# Altium schematic sheet ESP32P4.SchDoc
size A4; SheetNumber: 4; SheetTotal: 5
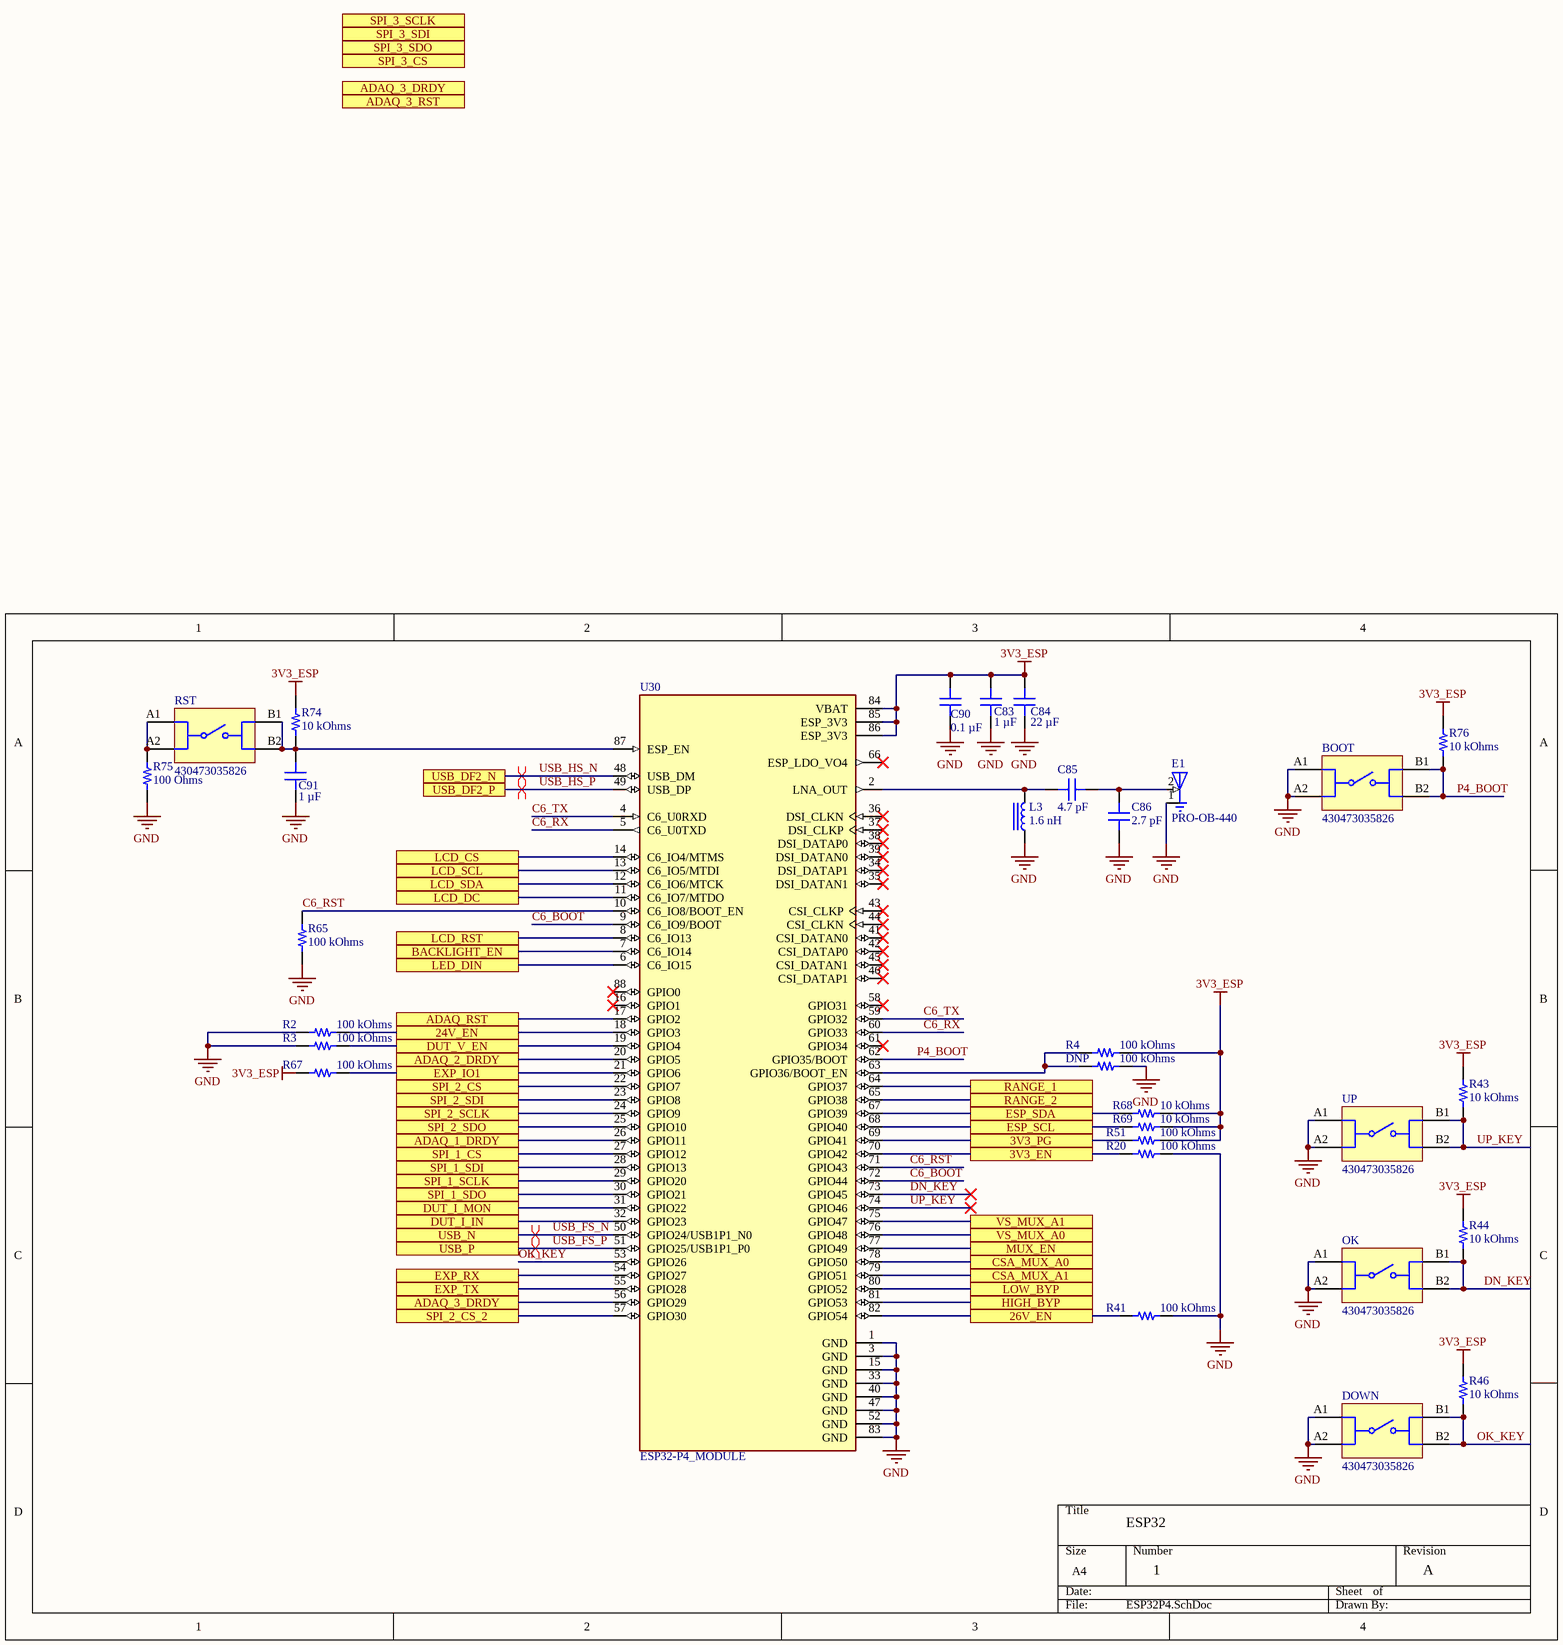
[diagram p0: ESP32P4.SchDoc]

## Parts
BOOT  430473035826  [430473035826]
C83  1 µF  [CAP 0603_1608]
C84  22 µF  [CAP 0603_1608]
C85  4.7 pF  [CAP 0603_1608]
C86  2.7 pF  [CAP 0603_1608]
C90  0.1 µF  [CAP 0603_1608]
C91  1 µF  [CAP 0603_1608]
DNP  100 kOhms  [RES 0603_1608]
DOWN  430473035826  [430473035826]
E1  PRO-OB-440  [XDCR_PRO-OB-440]
L3  1.6 nH  [Murata LQW18 0603]
OK  430473035826  [430473035826]
R2  100 kOhms  [RES 0603_1608]
R3  100 kOhms  [RES 0603_1608]
R4  100 kOhms  [RES 0603_1608]
R20  100 kOhms  [RES 0603_1608]
R41  100 kOhms  [RES 0603_1608]
R43  10 kOhms  [RES 0603_1608]
R44  10 kOhms  [RES 0603_1608]
R46  10 kOhms  [RES 0603_1608]
R51  100 kOhms  [RES 0603_1608]
R65  100 kOhms  [RES 0603_1608]
R67  100 kOhms  [RES 0603_1608]
R68  10 kOhms  [RES 0603_1608]
R69  10 kOhms  [RES 0603_1608]
R74  10 kOhms  [RES 0603_1608]
R75  100 Ohms  [RES 0603_1608]
R76  10 kOhms  [RES 0603_1608]
RST  430473035826  [430473035826]
U30  ESP32-P4_MODULE  [XCVR_ESP32-P4_MODULE]
UP  430473035826  [430473035826]

## Ports
3V3_EN, 3V3_PG, 24V_EN, 26V_EN, ADAQ_1_DRDY, ADAQ_2_DRDY, ADAQ_3_DRDY, ADAQ_3_RST, ADAQ_RST, BACKLIGHT_EN, CSA_MUX_A0, CSA_MUX_A1, DUT_I_IN, DUT_I_MON, DUT_V_EN, ESP_SCL, ESP_SDA, EXP_IO1, EXP_RX, EXP_TX, HIGH_BYP, LCD_CS, LCD_DC, LCD_RST, LCD_SCL, LCD_SDA, LED_DIN, LOW_BYP, MUX_EN, RANGE_1, RANGE_2, SPI_1_CS, SPI_1_SCLK, SPI_1_SDI, SPI_1_SDO, SPI_2_CS, SPI_2_CS_2, SPI_2_SCLK, SPI_2_SDI, SPI_2_SDO, SPI_3_CS, SPI_3_SCLK, SPI_3_SDI, SPI_3_SDO, USB_DF2_N, USB_DF2_P, USB_N, USB_P, VS_MUX_A0, VS_MUX_A1

## Nets
3V3_ESP: C83.2 C84.2 C90.2 R4.2 R43.2 R44.2 R46.2 R51.2 R67.1 R68.2 R69.2 R74.2 R76.2 U30.84(VBAT) U30.85(ESP_3V3) U30.86(ESP_3V3)
GND: BOOT.A1 BOOT.A2 C83.1 C84.1 C86.1 C90.1 C91.1 DNP.2 DOWN.A1 DOWN.A2 E1.1(GND) L3.1 OK.A1 OK.A2 R2.1 R3.1 R20.2 R41.2 R65.2 R75.1 U30.1(GND) U30.3(GND) U30.15(GND) U30.33(GND) U30.40(GND) U30.47(GND) U30.52(GND) U30.83(GND) UP.A1 UP.A2
3V3_EN: R20.1 U30.70(GPIO42) ; port 3V3_EN
3V3_PG: R51.1 U30.69(GPIO41) ; port 3V3_PG
24V_EN: R2.2 U30.18(GPIO3) ; port 24V_EN
26V_EN: R41.1 U30.82(GPIO54) ; port 26V_EN
ADAQ_1_DRDY: U30.26(GPIO11) ; port ADAQ_1_DRDY
ADAQ_2_DRDY: U30.20(GPIO5) ; port ADAQ_2_DRDY
ADAQ_3_DRDY: U30.56(GPIO29) ; port ADAQ_3_DRDY
ADAQ_RST: U30.17(GPIO2) ; port ADAQ_RST
BACKLIGHT_EN: U30.7(C6_IO14) ; port BACKLIGHT_EN
C6_BOOT: U30.9(C6_IO9/BOOT) U30.72(GPIO44)
C6_RST: R65.1 U30.10(C6_IO8/BOOT_EN) U30.71(GPIO43)
C6_RX: U30.5(C6_U0TXD) U30.60(GPIO33)
C6_TX: U30.4(C6_U0RXD) U30.59(GPIO32)
CSA_MUX_A0: U30.78(GPIO50) ; port CSA_MUX_A0
CSA_MUX_A1: U30.79(GPIO51) ; port CSA_MUX_A1
DN_KEY: OK.B1 OK.B2 R44.1 U30.73(GPIO45)
DUT_I_IN: U30.32(GPIO23) ; port DUT_I_IN
DUT_I_MON: U30.31(GPIO22) ; port DUT_I_MON
DUT_V_EN: R3.2 U30.19(GPIO4) ; port DUT_V_EN
ESP_SCL: R69.1 U30.68(GPIO40) ; port ESP_SCL
ESP_SDA: R68.1 U30.67(GPIO39) ; port ESP_SDA
EXP_IO1: R67.2 U30.21(GPIO6) ; port EXP_IO1
EXP_RX: U30.54(GPIO27) ; port EXP_RX
EXP_TX: U30.55(GPIO28) ; port EXP_TX
HIGH_BYP: U30.81(GPIO53) ; port HIGH_BYP
LCD_CS: U30.14(C6_IO4/MTMS) ; port LCD_CS
LCD_DC: U30.11(C6_IO7/MTDO) ; port LCD_DC
LCD_RST: U30.8(C6_IO13) ; port LCD_RST
LCD_SCL: U30.13(C6_IO5/MTDI) ; port LCD_SCL
LCD_SDA: U30.12(C6_IO6/MTCK) ; port LCD_SDA
LED_DIN: U30.6(C6_IO15) ; port LED_DIN
LOW_BYP: U30.80(GPIO52) ; port LOW_BYP
MUX_EN: U30.77(GPIO49) ; port MUX_EN
OK_KEY: DOWN.B1 DOWN.B2 R46.1 U30.53(GPIO26)
P4_BOOT: BOOT.B1 BOOT.B2 R76.1 U30.62(GPIO35/BOOT)
RANGE_1: U30.64(GPIO37) ; port RANGE_1
RANGE_2: U30.65(GPIO38) ; port RANGE_2
SPI_1_CS: U30.27(GPIO12) ; port SPI_1_CS
SPI_1_SCLK: U30.29(GPIO20) ; port SPI_1_SCLK
SPI_1_SDI: U30.28(GPIO13) ; port SPI_1_SDI
SPI_1_SDO: U30.30(GPIO21) ; port SPI_1_SDO
SPI_2_CS: U30.22(GPIO7) ; port SPI_2_CS
SPI_2_CS_2: U30.57(GPIO30) ; port SPI_2_CS_2
SPI_2_SCLK: U30.24(GPIO9) ; port SPI_2_SCLK
SPI_2_SDI: U30.23(GPIO8) ; port SPI_2_SDI
SPI_2_SDO: U30.25(GPIO10) ; port SPI_2_SDO
UP_KEY: R43.1 U30.74(GPIO46) UP.B1 UP.B2
USB_FS_N: U30.50(GPIO24/USB1P1_N0) ; port USB_N
USB_FS_P: U30.51(GPIO25/USB1P1_P0) ; port USB_P
USB_HS_N: U30.48(USB_DM) ; port USB_DF2_N
USB_HS_P: U30.49(USB_DP) ; port USB_DF2_P
VS_MUX_A0: U30.76(GPIO48) ; port VS_MUX_A0
VS_MUX_A1: U30.75(GPIO47) ; port VS_MUX_A1
NetC85_1: C85.1 C86.2 E1.2(FEED)
NetC85_2: C85.2 L3.2 U30.2(LNA_OUT)
NetC91_2: C91.2 R74.1 RST.B1 RST.B2 U30.87(ESP_EN)
NetDNP_1: DNP.1 R4.1 U30.63(GPIO36/BOOT_EN)
NetR75_2: R75.2 RST.A1 RST.A2

Not connected (* = marked no-connect by the designer): U30 16(GPIO1)* 34(DSI_DATAP1)* 35(DSI_DATAN1)* 36(DSI_CLKN)* 37(DSI_CLKP)* 38(DSI_DATAP0)* 39(DSI_DATAN0)* 41(CSI_DATAN0)* 42(CSI_DATAP0)* 43(CSI_CLKP)* 44(CSI_CLKN)* 45(CSI_DATAN1)* 46(CSI_DATAP1)* 58(GPIO31)* 61(GPIO34)* 66(ESP_LDO_VO4)* 88(GPIO0)*

## Layout directives
differential pair; differential pair class USB: USB_FS_N, USB_FS_P, USB_HS_N, USB_HS_P

## Notes on the sheet
- ESP32
- 1
- A

## Library data of the parts
BOOT DOWN OK RST UP = CMP-1455-00006-5: Switch Tactile Spst-no 0.05A 12V; Actuator Material: Liquid Crystal Polymer, Polymer; Switch Travel: 250µm; Throw Configuration: SPST; Illumination Type: Non-Illuminated; Insulation Resistance: 100MΩ; Current Rating: 50mA; Switch Function: Off-Mom; Mechanical Life: 500kcycles; Min Operating Temperature: -40°C; Packaging: Tape and Reel; Max Operating Temperature: 85°C; Mount: Surface Mount; Contact Plating: Silver; RoHS: Compliant; Voltage Rating: 12V; Height: 3.5mm
C83 C91 = GMC10X7R105M50NT: SMT Capacitor; manufacturer: Cal-Chip Electronics, Inc.; Temperature Coefficient: X7R; Tolerance: ±20%; Voltage - Rated: 50V; Part Number: GMC10X7R105M50NT; Applications: General Purpose; Capacitance: 1 µF; componentlink1description: Datasheet; componentlink1url: https://calchip.com/wp-content/uploads/2024/02/gmc_series-1.pdf; componentlink2description: DigiKey Link; componentlink2url: https://www.digikey.com/en/products/detail/cal-chip-electronics-inc/GMC10X7R105M50NT/25323876; Device Package: 0603 (1608 Metric); lastupdated: 06/04/2026 19:17:52; Lifecycle Status: Active; Minimum Order: 1; Mounting Type: Surface Mount, MLCC; Operating Temperature: -55°C ~ 125°C; Package / Case: 0603 (1608 Metric); packaging: TapeAndReel; partid: 65934; price: 0.06; series: GMC; Size / Dimension: 0.063" L x 0.031" W (1.60mm x 0.80mm); Supplier 1: DigiKey; Supplier Part Number 1: 4713-GMC10X7R105M50NTCT-ND; Thickness (Max): 0.037" (0.95mm); value: 1 µF
C84 = GRM188C61C226ME01D: SMT Capacitor; manufacturer: Murata Electronics; Temperature Coefficient: X5S; Tolerance: ±20%; Voltage - Rated: 16V; Part Number: GRM188C61C226ME01D; value: 22 µF; Applications: General Purpose; Capacitance: 22 µF; componentlink1description: Datasheet; componentlink1url: https://search.murata.co.jp/Ceramy/image/img/A01X/G101/ENG/GRM188C61C226ME01-01A.pdf; componentlink2description: DigiKey Link; componentlink2url: https://www.digikey.com/en/products/detail/murata-electronics/GRM188C61C226ME01D/22528395; Device Package: 0603 (1608 Metric); lastupdated: 06/04/2026 19:18:15; Lifecycle Status: Active; Minimum Order: 1; Mounting Type: Surface Mount, MLCC; Operating Temperature: -55°C ~ 85°C; Package / Case: 0603 (1608 Metric); packaging: TapeAndReel; partid: 60294; price: 0.08; series: GRM; Size / Dimension: 0.063" L x 0.031" W (1.60mm x 0.80mm); Supplier 1: DigiKey; Supplier Part Number 1: 490-GRM188C61C226ME01DCT-ND; Thickness (Max): 0.039" (1.00mm)
C85 = 06035C4R7KAT2A: SMT Capacitor; manufacturer: KYOCERA AVX; Temperature Coefficient: X7R; Tolerance: ±10%; Voltage - Rated: 50V; Part Number: 06035C4R7KAT2A; value: 4.7 pF; Applications: General Purpose; Capacitance: 4.7 pF; componentlink2description: DigiKey Link; componentlink2url: https://www.digikey.com/en/products/detail/kyocera-avx/06035C4R7KAT2A/11259106; Device Package: 0603 (1608 Metric); lastupdated: 06/04/2026 19:18:45; Lifecycle Status: Active; Minimum Order: 1; Mounting Type: Surface Mount, MLCC; Operating Temperature: -55°C ~ 125°C; Package / Case: 0603 (1608 Metric); packaging: TapeAndReel; partid: 68839; price: 0.03; series: -; Size / Dimension: 0.063" L x 0.032" W (1.60mm x 0.81mm); Supplier 1: DigiKey; Supplier Part Number 1: 478-06035C4R7KAT2ACT-ND; Thickness (Max): 0.035" (0.90mm)
C86 = C0603C279D5GAC7867: SMT Capacitor; manufacturer: KEMET; Temperature Coefficient: C0G, NP0; Tolerance: ±0.5pF; Voltage - Rated: 50V; Part Number: C0603C279D5GAC7867; value: 2.7 pF; Applications: General Purpose; Capacitance: 2.7 pF; componentlink1description: Datasheet; componentlink1url: https://api.kemet.com/component-edge/download/datasheet/C0603C279D5GACTU.pdf; componentlink2description: DigiKey Link; componentlink2url: https://www.digikey.com/en/products/detail/kemet/C0603C279D5GAC7867/2200451; Device Package: 0603 (1608 Metric); Features: Low ESL; lastupdated: 06/04/2026 19:22:23; Lifecycle Status: Active; Minimum Order: 1; Mounting Type: Surface Mount, MLCC; Operating Temperature: -55°C ~ 125°C; Package / Case: 0603 (1608 Metric); packaging: TapeAndReel; partid: 34968; Part Status: Active; price: 0.04; series: SMD Comm C0G; Size / Dimension: 0.063" L x 0.031" W (1.60mm x 0.80mm); Supplier 1: DigiKey; Supplier Part Number 1: 399-C0603C279D5GAC7867CT-ND; Thickness (Max): 0.034" (0.87mm)
C90 = C0603C104M5RACTU: SMT Capacitor; manufacturer: KEMET; Temperature Coefficient: X7R; Tolerance: ±20%; Voltage - Rated: 50V; Part Number: C0603C104M5RACTU; value: 0.1 µF; Applications: Bypass, Decoupling; Capacitance: 0.1 µF; componentlink1description: Datasheet; componentlink1url: https://api.kemet.com/component-edge/download/datasheet/C0603C104M5RACTU.pdf; componentlink2description: DigiKey Link; componentlink2url: https://www.digikey.com/en/products/detail/kemet/C0603C104M5RACTU/2199782; Device Package: 0603 (1608 Metric); lastupdated: 06/04/2026 19:22:47; Lifecycle Status: Active; Minimum Order: 1; Mounting Type: Surface Mount, MLCC; Operating Temperature: -55°C ~ 125°C; Package / Case: 0603 (1608 Metric); packaging: CutTape; partid: 69106; Part Status: Active; price: 0.01; series: SMD Comm X7R; Size / Dimension: 0.063" L x 0.031" W (1.60mm x 0.80mm); Supplier 1: DigiKey; Supplier Part Number 1: 399-C0603C104M5RACTUCT-ND; Thickness (Max): 0.034" (0.87mm)
DNP R2-R4 R20 R41 R51 R65 R67 = ERJ-PA3F1003V: RES SMD 100K OHM 1% 1/3W 0603; Manufacturer: Panasonic Electronic Components; Power (Watts): 0.333W 1/3W; Temperature Coefficient: Â±100ppm/Â°C; Tolerance: Â±1%; ComponentLink1Description: Datasheet; ComponentLink1URL: https://industrial.panasonic.com/cdbs/www-data/pdf/RDO0000/AOA0000C331.pdf; ComponentLink2Description: DigiKey Link; ComponentLink2URL: https://www.digikey.com/en/products/detail/panasonic-electronic-components/ERJ-PA3F1003V/5035850; Composition: Thick Film; Device Package: 0603 (1608 Metric); Features: Automotive AEC-Q200 Pulse Withstanding; Height - Seated (Max): 0.022\ (0.55mm); LastUpdated: 2024-02-09 20:42:57.243000; Lifecycle Status: Active; Part Number: ERJ-PA3F1003V; Minimum Order: 1; Number of Terminations: 2; Operating Temperature: -55Â°C ~ 155Â°C; Package / Case: 0603 (1608 Metric); Packaging: TapeAndReel; PartId: 14879; Part Status: Active; Price: 0.01; Ratings: AEC-Q200; Resistance: 100 kOhms; Series: ERJ-PA3; Size / Dimension: 0.063\ L x 0.031\ W (1.60mm x 0.80mm); Supplier 1: DigiKey; Supplier Part Number 1: P100KBYCT-ND; Supplier Device Package: 0603; Value: 100 kOhms
E1 = PRO-OB-440: 2.4GHz Bluetooth, WirelessHART, WLAN, Zigbeeâ„¢ Stamped Metal RF Antenna 2.4GHz ~ 2.5GHz - Solder Surface Mount; MF: Abracon; SnapEDA_Link: https://www.snapeda.com/parts/PRO-OB-440/Abracon/view-part/?ref=snap; Package: None; Value: *; MP: PRO-OB-440; Check_prices: https://www.snapeda.com/parts/PRO-OB-440/Abracon/view-part/?ref=eda
L3 = LQW18AS1N6J0ZD: FIXED IND 1.6NH 700MA 30MOHM SMD; Manufacturer: Murata Electronics; DC Resistance (DCR): 30mOhm Max; Frequency - Self Resonant: 12.5GHz; Inductance Frequency - Test: 250 MHz; Material - Core: Non-Magnetic; Q @ Freq: 24 @ 250MHz; Shielding: Unshielded; Tolerance: ±5%; Type: Wirewound; Part Number: LQW18AS1N6J0ZD; ComponentLink1Description: Datasheet; ComponentLink1URL: https://search.murata.co.jp/Ceramy/image/img/P02/JELF243A-9139.pdf; ComponentLink2Description: DigiKey Link; ComponentLink2URL: https://www.digikey.com/en/products/detail/murata-electronics/LQW18AS1N6J0ZD/6799231; Current Rating (Amps): 700 mA; Device Package: 0603 (1608 Metric); Height - Seated (Max): 0.039" (1.00mm); Inductance: 1.6 nH; LastUpdated: 05/04/2026 21:06:49; Lifecycle Status: Active; Minimum Order: 1; Mounting Type: Surface Mount; Operating Temperature: -55°C ~ 125°C; Package / Case: 0603 (1608 Metric); Packaging: TapeAndReel; PartId: 873; Part Status: Active; Price: 0.05; Ratings: AEC-Q200; Series: LQW18; Size / Dimension: 0.063" L x 0.031" W (1.60mm x 0.80mm); Supplier 1: DigiKey; Supplier Part Number 1: 490-15806-1-ND; Supplier Device Package: 0603 (1608 Metric); Value: 1.6 nH
R43 R44 R46 R68 R69 R74 R76 = ERJ-PA3F1002V: RES SMD 10K OHM 1% 1/3W 0603; Manufacturer: Panasonic Electronic Components; Power (Watts): 0.333W 1/3W; Temperature Coefficient: Â±100ppm/Â°C; Tolerance: Â±1%; ComponentLink1Description: Datasheet; ComponentLink1URL: https://industrial.panasonic.com/cdbs/www-data/pdf/RDO0000/AOA0000C331.pdf; ComponentLink2Description: DigiKey Link; ComponentLink2URL: https://www.digikey.com/en/products/detail/panasonic-electronic-components/ERJ-PA3F1002V/5035849; Composition: Thick Film; Device Package: 0603 (1608 Metric); Features: Automotive AEC-Q200 Pulse Withstanding; Height - Seated (Max): 0.022\ (0.55mm); LastUpdated: 2024-02-09 20:42:57.847000; Lifecycle Status: Active; Part Number: ERJ-PA3F1002V; Minimum Order: 1; Number of Terminations: 2; Operating Temperature: -55Â°C ~ 155Â°C; Package / Case: 0603 (1608 Metric); Packaging: TapeAndReel; PartId: 14698; Part Status: Active; Price: 0.01; Ratings: AEC-Q200; Resistance: 10 kOhms; Series: ERJ-PA3; Size / Dimension: 0.063\ L x 0.031\ W (1.60mm x 0.80mm); Supplier 1: DigiKey; Supplier Part Number 1: P10KBYCT-ND; Supplier Device Package: 0603; Value: 10 kOhms
R75 = ERJ-PA3F1000V: RES SMD 100 OHM 1% 1/3W 0603; Manufacturer: Panasonic Electronic Components; Power (Watts): 0.333W 1/3W; Temperature Coefficient: ±100ppm/°C; ComponentLink1Description: Datasheet; ComponentLink1URL: https://industrial.panasonic.com/cdbs/www-data/pdf/RDO0000/AOA0000C331.pdf; ComponentLink2Description: DigiKey Link; ComponentLink2URL: https://www.digikey.com/en/products/detail/panasonic-electronic-components/ERJ-PA3F1000V/5035847; Composition: Thick Film; Device Package: 0603 (1608 Metric); Features: Automotive AEC-Q200 Pulse Withstanding; Height - Seated (Max): 0.022\ (0.55mm); LastUpdated: 2024-02-09 20:42:52.130000; Lifecycle Status: Active; Part Number: ERJ-PA3F1000V; Minimum Order: 1; Number of Terminations: 2; Operating Temperature: -55°C ~ 155°C; Package / Case: 0603 (1608 Metric); Packaging: TapeAndReel; PartId: 16197; Part Status: Active; Price: 0.01; Ratings: AEC-Q200; Resistance: 100 Ohms; Series: ERJ-PA3; Size / Dimension: 0.063\ L x 0.031\ W (1.60mm x 0.80mm); Supplier 1: DigiKey; Supplier Part Number 1: P100BYCT-ND; Supplier Device Package: 0603; Tolerance: ±1%; Value: 100 Ohms
U30 = ESP32-P4_MODULE: Dual-core RISC-V high-performance module; MF: Waveshare Electronics; MP: ESP32-P4 Module; SnapEDA_Link: https://www.snapeda.com/parts/ESP32-P4%20Module/Waveshare+Electronics/view-part/?ref=snap; Package: None; Value: *; Check_prices: https://www.snapeda.com/parts/ESP32-P4%20Module/Waveshare+Electronics/view-part/?ref=eda